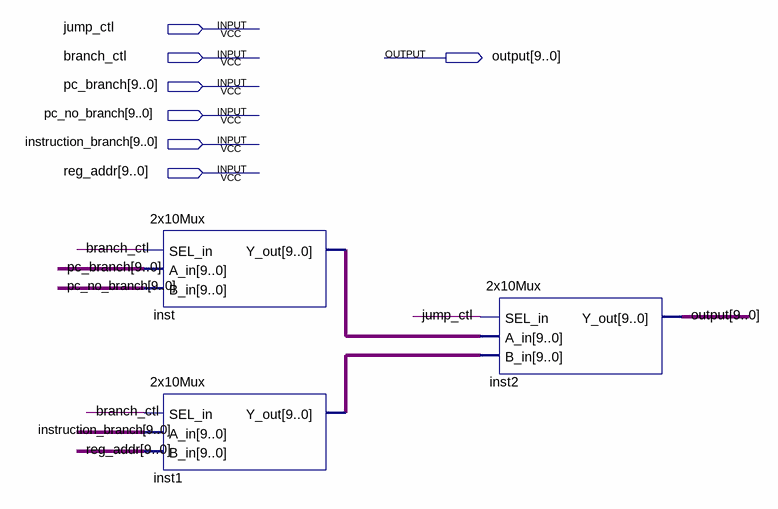
[diagram p0: schematic sheet]
// Quartus schematic 4x10mux.bdf as structural Verilog: 3 symbols, 7 pins
module \4x10mux  (
  input  jump_ctl,
  input  branch_ctl,
  input  [9:0] pc_branch,
  input  [9:0] pc_no_branch,
  input  [9:0] instruction_branch,
  input  [9:0] reg_addr,
  output [9:0] \output 
);

  wire [9:0] inst1_y_out, inst_y_out;

  \2x10Mux  inst (.SEL_in(branch_ctl), .A_in(pc_branch), .B_in(pc_no_branch), .Y_out(inst_y_out));
  \2x10Mux  inst1 (.SEL_in(branch_ctl), .A_in(instruction_branch), .B_in(reg_addr), .Y_out(inst1_y_out));
  \2x10Mux  inst2 (.SEL_in(jump_ctl), .A_in(inst_y_out), .B_in(inst1_y_out), .Y_out(\output ));
endmodule
